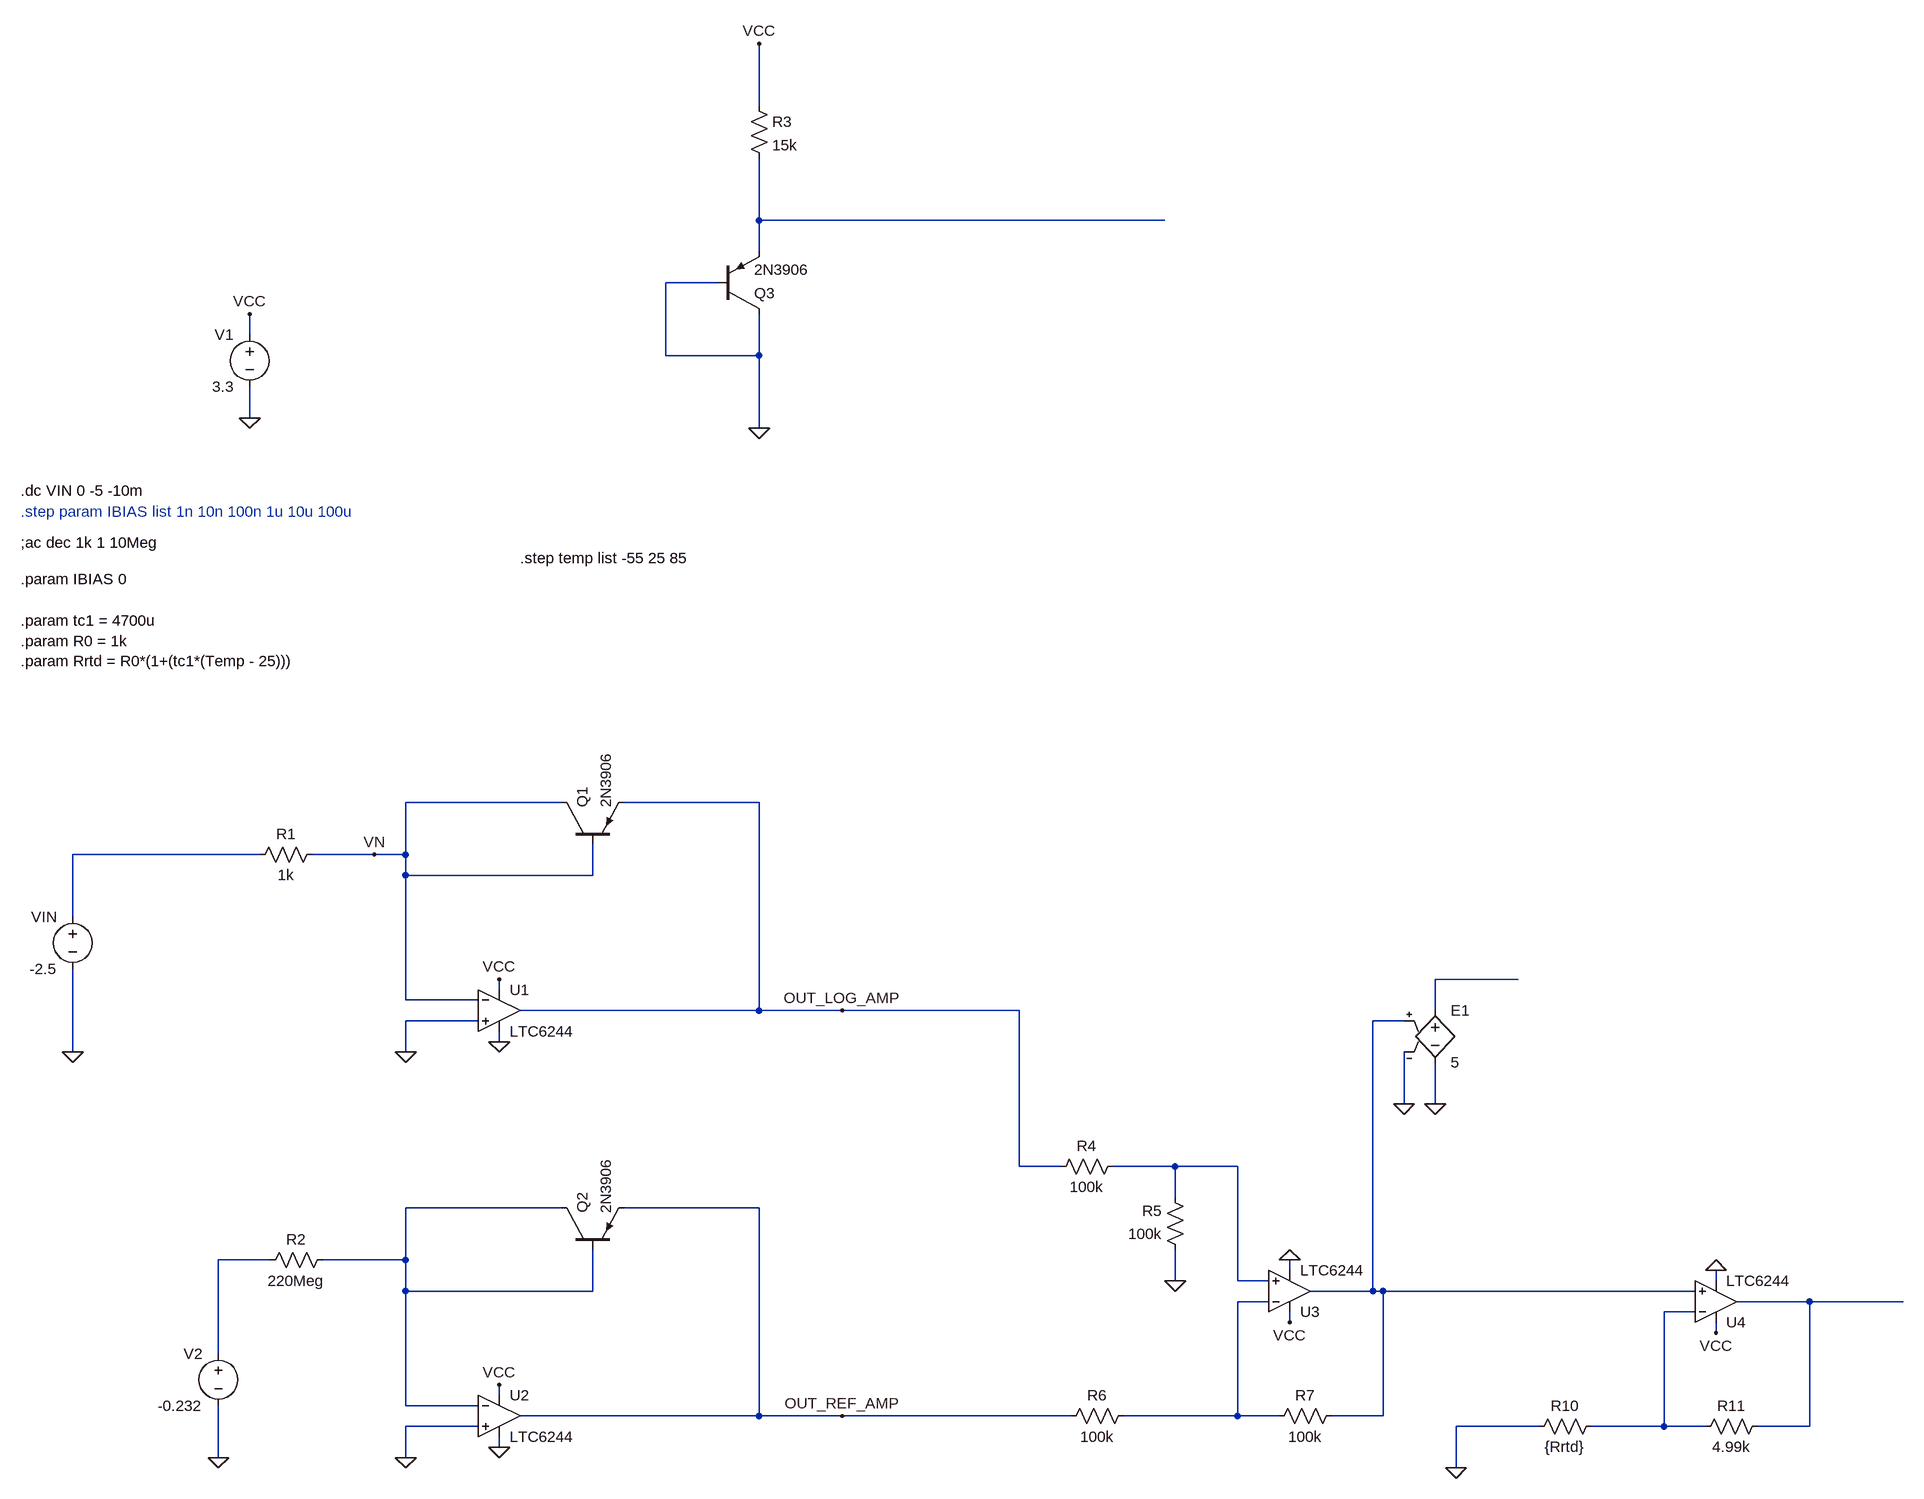
[diagram p0: schematic Temp_Compensated_Log_Amp.asc]
Temp_Compensated_Log_Amp.asc, the LTspice schematic file:
Version 4
SHEET 1 6324 2276
WIRE 336 -1280 336 -1376
WIRE 336 -1104 336 -1200
WIRE 960 -1104 336 -1104
WIRE 336 -1056 336 -1104
WIRE 272 -1008 192 -1008
WIRE -448 -928 -448 -960
WIRE 192 -896 192 -1008
WIRE 336 -896 336 -960
WIRE 336 -896 192 -896
WIRE -448 -800 -448 -848
WIRE 336 -784 336 -896
WIRE 32 -208 -208 -208
WIRE 336 -208 128 -208
WIRE -432 -128 -720 -128
WIRE -256 -128 -352 -128
WIRE -208 -128 -208 -208
WIRE -208 -128 -256 -128
WIRE -208 -96 -208 -128
WIRE 80 -96 80 -144
WIRE 80 -96 -208 -96
WIRE -720 -32 -720 -128
WIRE 1504 64 1376 64
WIRE -64 80 -64 64
WIRE -208 96 -208 -96
WIRE -96 96 -208 96
WIRE 336 112 336 -208
WIRE 336 112 -32 112
WIRE 464 112 336 112
WIRE 736 112 464 112
WIRE 1376 112 1376 64
WIRE -96 128 -208 128
WIRE 1328 128 1280 128
WIRE -64 160 -64 144
WIRE -720 176 -720 48
WIRE -208 176 -208 128
WIRE 1328 256 1328 176
WIRE 1376 256 1376 192
WIRE 736 352 736 112
WIRE 800 352 736 352
WIRE 976 352 880 352
WIRE 1072 352 976 352
WIRE 976 400 976 352
WIRE 32 416 -208 416
WIRE 336 416 128 416
WIRE -416 496 -496 496
WIRE -208 496 -208 416
WIRE -208 496 -336 496
WIRE 1152 512 1152 496
WIRE 976 528 976 480
WIRE 1072 528 1072 352
WIRE 1120 528 1072 528
WIRE 1808 528 1808 512
WIRE -208 544 -208 496
WIRE 80 544 80 480
WIRE 80 544 -208 544
WIRE 1280 544 1280 128
WIRE 1280 544 1184 544
WIRE 1296 544 1280 544
WIRE 1776 544 1296 544
WIRE 1120 560 1072 560
WIRE 1952 560 1840 560
WIRE 2096 560 1952 560
WIRE 1776 576 1728 576
WIRE 1152 592 1152 576
WIRE 1808 608 1808 592
WIRE -496 640 -496 496
WIRE -64 704 -64 688
WIRE -208 720 -208 544
WIRE -96 720 -208 720
WIRE 336 736 336 416
WIRE 336 736 -32 736
WIRE 464 736 336 736
WIRE 816 736 464 736
WIRE 1072 736 1072 560
WIRE 1072 736 896 736
WIRE 1136 736 1072 736
WIRE 1296 736 1296 544
WIRE 1296 736 1216 736
WIRE -96 752 -208 752
WIRE 1536 752 1408 752
WIRE 1728 752 1728 576
WIRE 1728 752 1616 752
WIRE 1792 752 1728 752
WIRE 1952 752 1952 560
WIRE 1952 752 1872 752
WIRE -64 784 -64 768
WIRE -496 800 -496 720
WIRE -208 800 -208 752
WIRE 1408 816 1408 752
FLAG -64 160 0
FLAG -64 64 VCC
FLAG -208 176 0
FLAG -448 -960 VCC
FLAG -448 -800 0
FLAG 464 112 OUT_LOG_AMP
FLAG -256 -128 VN
FLAG 336 -784 0
FLAG 336 -1376 VCC
FLAG -64 784 0
FLAG -64 688 VCC
FLAG -208 800 0
FLAG 464 736 OUT_REF_AMP
FLAG -496 800 0
FLAG 1152 496 0
FLAG 1152 592 VCC
FLAG 976 528 0
FLAG 1808 512 0
FLAG 1808 608 VCC
FLAG 1408 816 0
FLAG 1328 256 0
FLAG 1376 256 0
FLAG -720 176 0
SYMBOL voltage -448 -944 M0
WINDOW 123 0 0 Left 0
WINDOW 39 0 0 Left 0
SYMATTR InstName V1
SYMATTR Value 3.3
SYMBOL pnp 32 -144 R270
SYMATTR InstName Q1
SYMATTR Value 2N3906
SYMBOL Opamps\\LTC6244 -64 112 R0
SYMATTR InstName U1
SYMBOL pnp 272 -960 M180
SYMATTR InstName Q3
SYMATTR Value 2N3906
SYMBOL res 320 -1296 R0
SYMATTR InstName R3
SYMATTR Value 15k
SYMBOL res -320 480 R90
WINDOW 0 0 56 VBottom 2
WINDOW 3 32 56 VTop 2
SYMATTR InstName R2
SYMATTR Value 220Meg
SYMBOL pnp 32 480 R270
SYMATTR InstName Q2
SYMATTR Value 2N3906
SYMBOL Opamps\\LTC6244 -64 736 R0
SYMATTR InstName U2
SYMBOL voltage -496 624 M0
WINDOW 123 0 0 Left 0
WINDOW 39 0 0 Left 0
SYMATTR InstName V2
SYMATTR Value -0.232
SYMBOL Opamps\\LTC6244 1152 544 M180
SYMATTR InstName U3
SYMBOL res 896 336 R90
WINDOW 0 0 56 VBottom 2
WINDOW 3 32 56 VTop 2
SYMATTR InstName R4
SYMATTR Value 100k
SYMBOL res 992 496 R180
WINDOW 0 36 76 Left 2
WINDOW 3 36 40 Left 2
SYMATTR InstName R5
SYMATTR Value 100k
SYMBOL res 912 720 R90
WINDOW 0 0 56 VBottom 2
WINDOW 3 32 56 VTop 2
SYMATTR InstName R6
SYMATTR Value 100k
SYMBOL res 1232 720 R90
WINDOW 0 0 56 VBottom 2
WINDOW 3 32 56 VTop 2
SYMATTR InstName R7
SYMATTR Value 100k
SYMBOL Opamps\\LTC6244 1808 560 M180
SYMATTR InstName U4
SYMBOL res 1632 736 R90
WINDOW 0 0 56 VBottom 2
WINDOW 3 32 56 VTop 2
SYMATTR InstName R10
SYMATTR Value {Rrtd}
SYMBOL res 1888 736 R90
WINDOW 0 0 56 VBottom 2
WINDOW 3 32 56 VTop 2
SYMATTR InstName R11
SYMATTR Value 4.99k
SYMBOL e 1376 96 R0
SYMATTR InstName E1
SYMATTR Value 5
SYMBOL res -336 -144 R90
WINDOW 0 0 56 VBottom 2
WINDOW 3 32 56 VTop 2
SYMATTR InstName R1
SYMATTR Value 1k
SYMBOL voltage -720 -48 M0
WINDOW 123 0 0 Left 0
WINDOW 39 0 0 Left 0
SYMATTR InstName VIN
SYMATTR Value -2.5
TEXT -800 -688 Left 2 !.dc VIN 0 -5 -10m
TEXT -32 -584 Left 2 !.step temp list -55 25 85
TEXT -800 -656 Left 2 ;.step param IBIAS list 1n 10n 100n 1u 10u 100u
TEXT -800 -608 Left 2 !;ac dec 1k 1 10Meg
TEXT -800 -552 Left 2 !.param IBIAS 0
TEXT -800 -488 Left 2 !.param tc1 = 4700u\n.param R0 = 1k\n.param Rrtd = R0*(1+(tc1*(Temp - 25)))

The netlist it stands for:
* Temp_Compensated_Log_Amp.asc
V1 VCC 0 3.3
Q1 VN VN OUT_LOG_AMP 0 2N3906
XU1 0 VN VCC 0 OUT_LOG_AMP LTC6244  ; pins In+ In- V+ V- OUT
Q3 0 0 N001 0 2N3906
R3 VCC N001 15k
R2 N006 N007 220Meg
Q2 N006 N006 OUT_REF_AMP 0 2N3906
XU2 0 N006 VCC 0 OUT_REF_AMP LTC6244  ; pins In+ In- V+ V- OUT
V2 N007 0 -0.232
XU3 N005 N008 VCC 0 N004 LTC6244  ; pins In+ In- V+ V- OUT
R4 N005 OUT_LOG_AMP 100k
R5 0 N005 100k
R6 N008 OUT_REF_AMP 100k
R7 N004 N008 100k
XU4 N004 N010 VCC 0 N009 LTC6244  ; pins In+ In- V+ V- OUT
R10 N010 0 {Rrtd}
R11 N009 N010 4.99k
E1 N003 0 N004 0 5
R1 VN N002 1k
VIN N002 0 -2.5
.model NPN NPN
.model PNP PNP
.lib standard.bjt
.dc VIN 0 -5 -10m
.step temp list -55 25 85
* .step param IBIAS list 1n 10n 100n 1u 10u 100u
;ac dec 1k 1 10Meg
.param IBIAS 0
.param tc1 = 4700u
.param R0 = 1k
.param Rrtd = R0*(1+(tc1*(Temp - 25)))
.backanno
.end